# EAGLE design adc_dev (EAGLE 6.5.0)
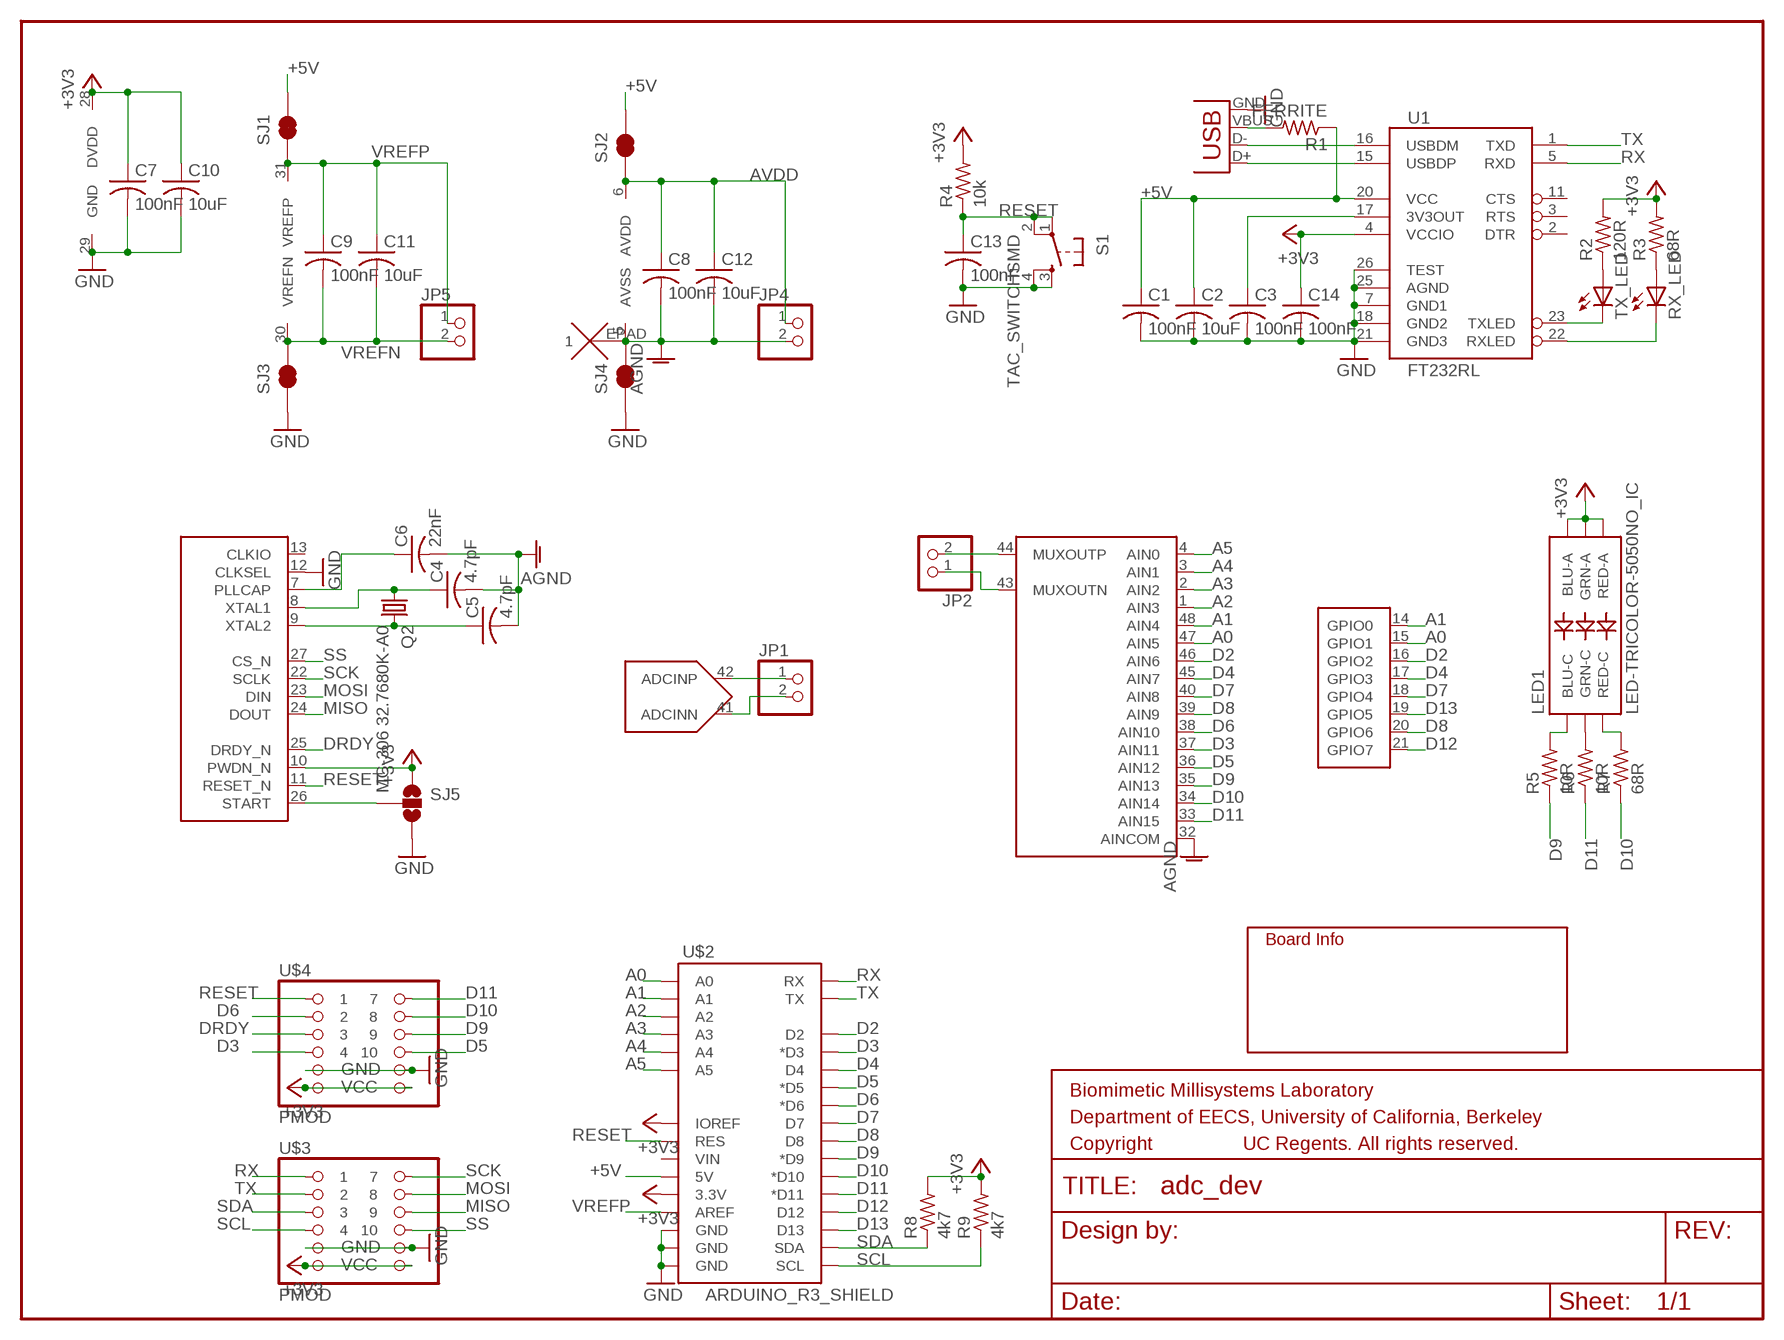
[diagram p0: schematic, sheet 1]

## Parts
C1  100nF  C-USC0603  [C0603]
C2  10uF  C-USC0603  [C0603]
C3  100nF  C-USC0603  [C0603]
C4  4.7pF  C-USC0603  [C0603]
C5  4.7pF  C-USC0603  [C0603]
C6  22nF  C-USC0603  [C0603]
C7  100nF  C-USC0603  [C0603]
C8  100nF  C-USC0603  [C0603]
C9  100nF  C-USC0603  [C0603]
C10  10uF  C-USC0603  [C0603]
C11  10uF  C-USC0603  [C0603]
C12  10uF  C-USC0603  [C0603]
C13  100nF  C-USC0603  [C0603]
C14  100nF  C-USC0603  [C0603]
JP1  PINHD-1X2  [1X02]
JP2  PINHD-1X2  [1X02]
JP3  USBSMD  [USB-MINIB]
JP4  PINHD-1X2  [1X02]
JP5  PINHD-1X2  [1X02]
LED1  LED-TRICOLOR-5050NO_IC  [LED-TRICOLOR-5050]
Q2  MC-306 32.7680K-A0  MC-306  [MC-306]
R1  FERRITE  R-US_R0603  [R0603]
R2  120R  R-US_R0603  [R0603]
R3  68R  R-US_R0603  [R0603]
R4  10k  R-US_R0603  [R0603]
R5  10R  R-US_R0603  [R0603]
R6  10R  R-US_R0603  [R0603]
R7  68R  R-US_R0603  [R0603]
R8  4k7  R-US_R0603  [R0603]
R9  4k7  R-US_R0603  [R0603]
RX_LED  LEDCHIPLED_0603  [CHIPLED_0603]
S1  TAC_SWITCHSMD  [TACTILE_SWITCH_SMD]
SJ1  JUMPER-PAD-2-NC_BY_TRACE  [PAD-JUMPER-2-NC_BY_TRACE_YES_SILK]
SJ2  JUMPER-PAD-2-NC_BY_TRACE  [PAD-JUMPER-2-NC_BY_TRACE_YES_SILK]
SJ3  JUMPER-PAD-2-NC_BY_TRACE  [PAD-JUMPER-2-NC_BY_TRACE_YES_SILK]
SJ4  JUMPER-PAD-2-NC_BY_TRACE  [PAD-JUMPER-2-NC_BY_TRACE_YES_SILK]
SJ5  JUMPER-PAD-3-NOYES_SILK  [PAD-JUMPER-3-NO_YES_SILK]
TX_LED  LEDCHIPLED_0603  [CHIPLED_0603]
U1  FT232RL  FT232RL-BASICSSOP  [SSOP28DB]
U$1  ADS1258  [QFN-48]
U$2  ARDUINO_R3_SHIELD  [UNO_R3_SHIELD]
U$3  PMOD  [2X06]
U$4  PMOD  [2X06]
U$5  INFO  [INFO]

## Nets
+3V3: C7.1 C10.1 C14.1 LED1.1(GRN-A) LED1.2(RED-A) LED1.3(BLU-A) R2.2 R3.2 R4.2 R8.2 R9.2 SJ5.1 U1.4(VCCIO) U$1.10(CTRL:PWDN_N) U$1.28(GND-DVDD:DVDD) U$2.3.3V U$2.IOREF U$3.11 U$3.12 U$4.11 U$4.12
+5V: C1.1 C2.1 R1.1 SJ1.2 SJ2.2 U1.20(VCC) U$2.5V
A0: U$1.15(GPIO:GPIO1) U$1.47(MUX:AIN5) U$2.A0
A1: U$1.14(GPIO:GPIO0) U$1.48(MUX:AIN4) U$2.A1
A2: U$1.1(MUX:AIN3) U$2.A2
A3: U$1.2(MUX:AIN2) U$2.A3
A4: U$1.3(MUX:AIN1) U$2.A4
A5: U$1.4(MUX:AIN0) U$2.A5
ADCN: JP1.2 U$1.41(ADC:ADCINN)
ADCP: JP1.1 U$1.42(ADC:ADCINP)
AGND: C4.2 C5.2 C6.2 C8.2 C12.2 JP4.2 SJ4.2 U$1.5(AVDD-AVSS:AVSS) U$1.32(MUX:AINCOM) U$1.EPAD
AVDD: C8.1 C12.1 JP4.1 SJ2.1 U$1.6(AVDD-AVSS:AVDD)
D2: U$1.16(GPIO:GPIO2) U$1.46(MUX:AIN6) U$2.D2
D3: U$1.37(MUX:AIN11) U$2.D3(*D3) U$4.7
D4: U$1.17(GPIO:GPIO3) U$1.45(MUX:AIN7) U$2.D4
D5: U$1.36(MUX:AIN12) U$2.D5(*D5) U$4.8
D6: U$1.38(MUX:AIN10) U$2.D6(*D6) U$4.3
D7: U$1.18(GPIO:GPIO4) U$1.40(MUX:AIN8) U$2.D7
D8: U$1.20(GPIO:GPIO6) U$1.39(MUX:AIN9) U$2.D8
D9: R5.1 U$1.35(MUX:AIN13) U$2.D9(*D9) U$4.6
D10: R7.1 U$1.34(MUX:AIN14) U$2.D10(*D10) U$4.4
D11: R6.1 U$1.33(MUX:AIN15) U$2.D11(*D11) U$4.2
D12: U$1.21(GPIO:GPIO7) U$2.D12
D13: U$1.19(GPIO:GPIO5) U$2.D13
DRDY: U$1.25(CTRL:DRDY_N) U$4.5
GND: C1.2 C2.2 C3.2 C7.2 C10.2 C13.2 C14.2 JP3.GND S1.3 S1.4 SJ3.1 SJ4.1 SJ5.3 U1.7(GND1) U1.18(GND2) U1.21(GND3) U1.25(AGND) U1.26(TEST) U$1.12(CTRL:CLKSEL) U$1.29(GND-DVDD:GND) U$2.GND@0(GND) U$2.GND@1(GND) U$2.GND@2(GND) U$3.9 U$3.10 U$4.9 U$4.10
MISO: U$1.24(CTRL:DOUT) U$3.6
MOSI: U$1.23(CTRL:DIN) U$3.4
MUXN: JP2.1 U$1.43(MUX:MUXOUTN)
MUXP: JP2.2 U$1.44(MUX:MUXOUTP)
N$1: JP3.D+ U1.15(USBDP)
N$2: JP3.D- U1.16(USBDM)
N$3: R2.1 TX_LED.A
N$4: R3.1 RX_LED.A
N$5: C3.1 U1.17(3V3OUT)
N$6: SJ5.2 U$1.26(CTRL:START)
N$7: JP3.VBUS R1.2
N$8: TX_LED.C U1.23(TXLED)
N$9: RX_LED.C U1.22(RXLED)
N$13: C6.1 U$1.7(CTRL:PLLCAP)
N$14: C4.1 Q2.1 U$1.8(CTRL:XTAL1)
N$15: C5.1 Q2.4 U$1.9(CTRL:XTAL2)
N$17: LED1.4(BLU-C) R5.2
N$18: LED1.6(GRN-C) R6.2
N$21: LED1.5(RED-C) R7.2
RESET: C13.1 R4.1 S1.1 S1.2 U$1.11(CTRL:RESET_N) U$2.RES U$4.1
RX: U1.5(RXD) U$2.RX U$3.1
SCK: U$1.22(CTRL:SCLK) U$3.2
SCL: R9.1 U$2.SCL U$3.7
SDA: R8.1 U$2.SDA U$3.5
SS: U$1.27(CTRL:CS_N) U$3.8
TX: U1.1(TXD) U$2.TX U$3.3
VREFN: C9.2 C11.2 JP5.2 SJ3.2 U$1.30(VREFN-VREFP:VREFN)
VREFP: C9.1 C11.1 JP5.1 SJ1.1 U$1.31(VREFN-VREFP:VREFP) U$2.AREF
Unconnected: U1.2(DTR) U1.3(RTS) U1.11(CTS) U$1.13(CTRL:CLKIO) U$2.VIN

## Library data of the parts
C1-C14 = rcl:C-US: CAPACITOR, American symbol
JP1 JP2 JP4 JP5 = pinhead:PINHD-1X2: PIN HEADER
JP3 = SparkFun-Connectors:USB: USB Connectors USB-B-PTH is fully proven SKU : PRT-00139/CONN-08278 USB-miniB is fully proven SKU : PRT-00587 USB-A-PCB is untested. USB-A-H is throughly reviewed, but untested. Spark Fun Electronics SKU : PRT-00437 USB-B-SMT is throughly reviewed, but untested. Needs silkscreen touching up. USB-A-S has not been used/tested USB-MB-H has not been used/tested USB-MICROB has been used. CONN-09505; PROD_ID: CONN-08193
LED1 = SparkFun-LED:LED-TRICOLOR-5050
Q2 = crystal:MC-306: kHz RANGE CRYSTAL UNIT SMD Source: MC-306_405_406_E07X.PDF Homepage <http://www.epsontoyocom.co.jp>; MPN: MC-306 60.0KHZ 100PPM ,12.5PF; OC_FARNELL: 1278040; OC_NEWARK: 31M5576
R1-R9 = rcl:R-US_: RESISTOR, American symbol
RX_LED TX_LED = led:LED: LED OSRAM: - CHIPLED LG R971, LG N971, LY N971, LG Q971, LY Q971, LO R971, LY R971 LH N974, LH R974 LS Q976, LO Q976, LY Q976 LO Q996 - Hyper CHIPLED LW Q18S LB Q993, LB Q99A, LB R99A - SideLED LS A670, LO A670, LY A670, LG A670, LP A670 LB A673, LV A673, LT A673, LW A673 LH A674 LY A675 LS A676, LA A676, LO A676, LY A676, LW A676 LS A679, LY A679, LG A679 - Hyper Micro SIDELED® LS Y876, LA Y876, LO Y876, LY Y876 LT Y87S - SmartLED LW L88C, LW L88S LB L89C, LB L89S, LG L890 LS L89K, LO L89K, LY L89K LS L896, LA L896, LO L896, LY L896 - TOPLED LS T670, LO T670, LY T670, LG T670, LP T670 LSG T670, LSP T670, LSY T670, LOP T670, LYG T670 LG T671, LOG T671, LSG T671 LB T673, LV T673, LT T673, LW T673 LH T674 LS T676, LA T676, LO T676, LY T676, LB T676, LH T676, LSB T676, LW T676 LB T67C, LV T67C, LT T67C, LS T67K, LO T67K, LY T67K, LW E67C LS E67B, LA E67B, LO E67B, LY E67B, LB E67C, LV E67C, LT E67C LW T67C LS T679, LY T679, LG T679 LS T770, LO T770, LY T770, LG T770, LP T770 LB T773, LV T773, LT T773, LW T773 LH T774 LS E675, LA E675, LY E675, LS T675 LS T776, LA T776, LO T776, LY T776, LB T776 LHGB T686 LT T68C, LB T68C - Hyper Mini TOPLED® LB M676 - Mini TOPLED Santana® LG M470 LS M47K, LO M47K, LY M47K Source: http://www.osram.convergy.de LUXEON: - LUMILED® LXK2-PW12-R00, LXK2-PW12-S00, LXK2-PW14-U00, LXK2-PW14-V00 LXK2-PM12-R00, LXK2-PM12-S00, LXK2-PM14-U00 LXK2-PE12-Q00, LXK2-PE12-R00, LXK2-PE12-S00, LXK2-PE14-T00, LXK2-PE14-U00 LXK2-PB12-K00, LXK2-PB12-L00, LXK2-PB12-M00, LXK2-PB14-N00, LXK2-PB14-P00, LXK2-PB14-Q00 LXK2-PR12-L00, LXK2-PR12-M00, LXK2-PR14-Q00, LXK2-PR14-R00 LXK2-PD12-Q00, LXK2-PD12-R00, LXK2-PD12-S00 LXK2-PH12-R00, LXK2-PH12-S00 LXK2-PL12-P00, LXK2-PL12-Q00, LXK2-PL12-R00 Source: www.luxeon.com KINGBRIGHT: KA-3528ASYC Source: www.kingbright.com
S1 = SparkFun-Electromechanical:TAC_SWITCH: Momentary Switch Button commonly used for reset or general input. Spark Fun Electronics SKU : COM-00097 SMT- SWCH-08247; PROD_ID: SWCH-08247
SJ1-SJ4 = SparkFun-Passives:JUMPER-PAD-2-NC_BY_TRACE
SJ5 = SparkFun-Passives:JUMPER-PAD-3-NO
U1 = SparkFun-DigitalIC:FT232RL-BASIC: USB UART This is the simplified version of the FT232RL unit. Only what you need, nothing you don't. Spark Fun Electronics SKU : COM-00650
U$1 = modular_robotics:ADS1258
U$2 = SparkFun-Boards:ARDUINO_R3_SHIELD: Shield form compatible with the Arduino Uno R3.
U$3 U$4 = modular_robotics:PMOD
U$5 = modular_robotics:INFO; AUTHOR: Austin Buchan; DATE: Nov 18, 2014; DESIGN: Zedboard Arduino Adapter; ORGANIZATION: UC Berkeley ASPIRE; REVISION: r0.1

## Board
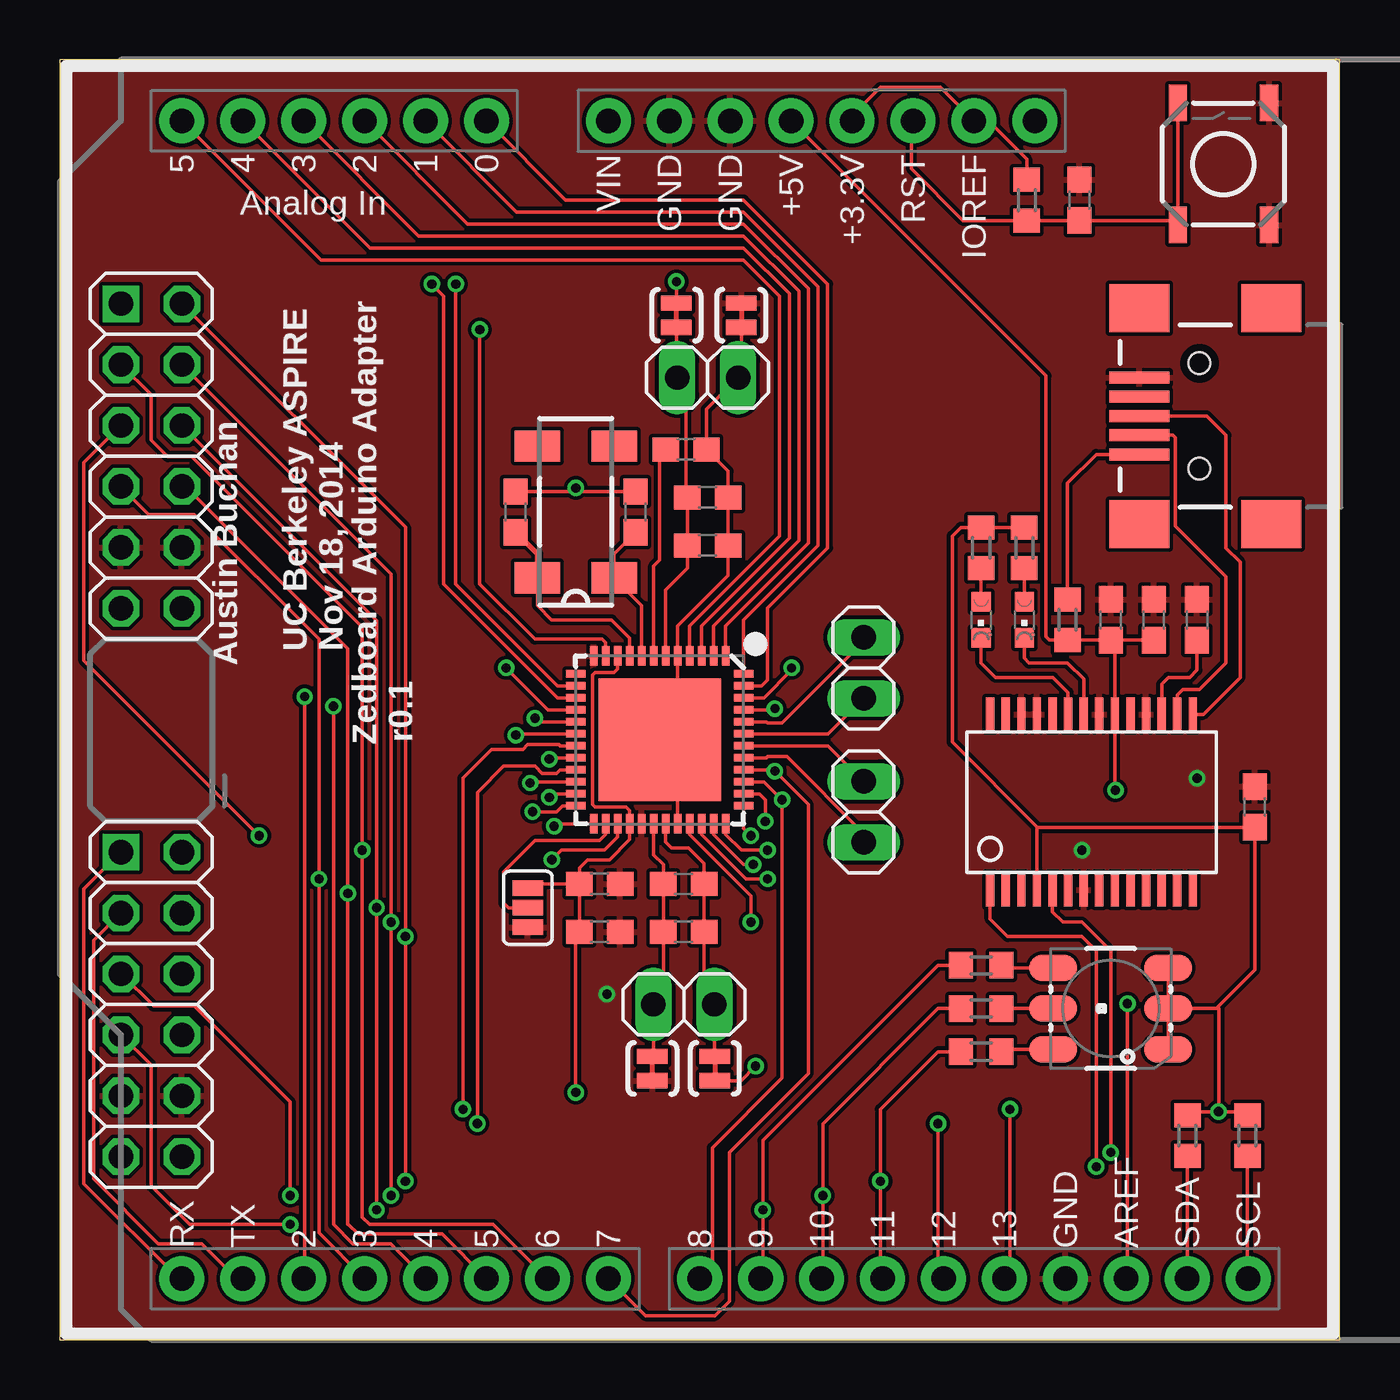
[diagram p1: board, top side]
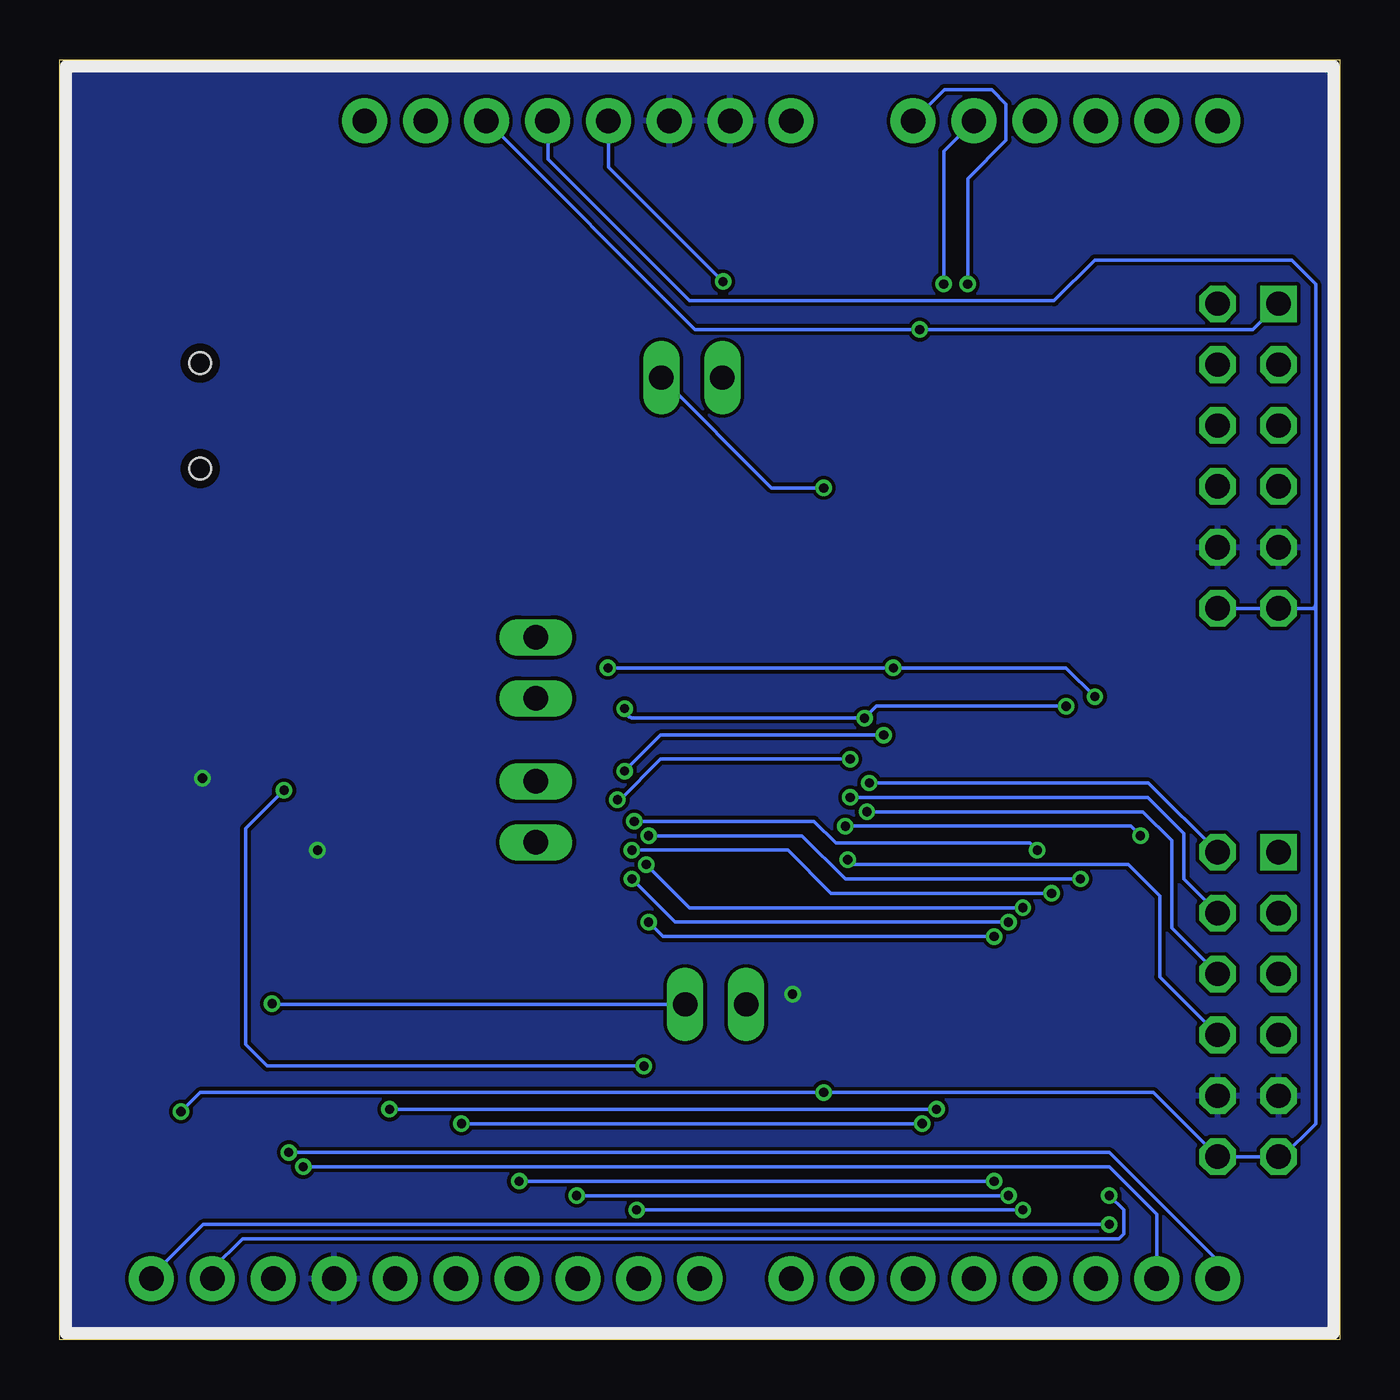
[diagram p2: board, bottom side, seen from below]

Size 53.34 x 53.34 mm. Coordinates in mm from the lower left corner, seen from the top.
Outline: 0,0 53.34,0 53.34,53.34 0,53.34 0,0
Copper layers (1*2+15*16): Top 0.035mm / dielectric 1.5mm / Route2 0.035mm / dielectric 0.15mm / Route15 0.035mm / dielectric 0.2mm / Bottom 0.035mm
Design rules "66each *": minimum track width 6mil, minimum drill 15mil, track to track 6mil, track to pad 6mil, pad to pad 6mil, via to via 6mil, smd to smd 6mil, copper to edge 6mil, drill to drill 10mil, minimum pad ring 6mil, minimum via ring 6mil, stop-mask expansion 4mil, vias tented up to drill 14mil, thermal gap 6mil
tRestrict: area 46.7,39.9 to 48.3,41.5; area 46.7,35.5 to 48.3,37.1
bRestrict: area 46.7,35.5 to 48.3,37.1; area 46.7,39.9 to 48.3,41.5

### Footprints (pad centres in the part's own frame; a part is rotated, then mirrored left to right if it is on the bottom)
C0603 = smd 1.1 x 1: 1 -0.85,0; 2 0.85,0
1X02 = drill 1.016 long: 1 -1.27,0; 2 1.27,0
USB-MINIB = smd 2.5 x 0.5: D+ 2.5,0; D- 2.5,0.8; GND 2.5,-1.6; ID 2.5,-0.8; VBUS 2.5,1.6 | smd 2.5 x 2: MTN1 -3,4.5; MTN2 2.5,4.5; MTN3 -3,-4.5; MTN4 2.5,-4.5 | hole 0.9: 0,2.2; 0,-2.2
LED-TRICOLOR-5050 = smd 2 x 1.1: 1 -2.4,1.7; 2 -2.4,0; 3 -2.4,-1.7; 4 2.4,-1.7; 5 2.4,0; 6 2.4,1.7
MC-306 = smd 1.3 x 1.9: 1 -2.75,-1.6; 2 2.75,-1.6; 3 2.75,1.6; 4 -2.75,1.6
R0603 = smd 1 x 1.1: 1 -0.85,0; 2 0.85,0
CHIPLED_0603 = smd 0.8 x 0.8: A 0,-0.75; C 0,0.75
TACTILE_SWITCH_SMD = smd 1.524 x 0.762: 1 -2.54,1.905; 2 2.54,1.905; 3 -2.54,-1.905; 4 2.54,-1.905
PAD-JUMPER-2-NC_BY_TRACE_YES_SILK = smd 0.635 x 1.27: 1 -0.508,0; 2 0.508,0
PAD-JUMPER-3-NO_YES_SILK = smd 0.635 x 1.27: 1 -0.813,0; 2 0,0; 3 0.813,0
SSOP28DB = smd 0.348 x 1.397: 1 -4.225,-3.656; 2 -3.575,-3.656; 3 -2.925,-3.656; 4 -2.275,-3.656; 5 -1.625,-3.656; 6 -0.975,-3.656; 7 -0.325,-3.656; 8 0.325,-3.656; 9 0.975,-3.656; 10 1.625,-3.656; 11 2.275,-3.656; 12 2.925,-3.656; 13 3.575,-3.656; 14 4.225,-3.656; 15 4.225,3.656; 16 3.575,3.656; 17 2.925,3.656; 18 2.275,3.656; 19 1.625,3.656; 20 0.975,3.656; 21 0.325,3.656; 22 -0.325,3.656; 23 -0.975,3.656; 24 -1.625,3.656; 25 -2.275,3.656; 26 -2.925,3.656; 27 -3.575,3.656; 28 -4.225,3.656
QFN-48 = smd 0.8 x 0.3: 1 -3.5,2.75; 2 -3.5,2.25; 3 -3.5,1.75; 4 -3.5,1.25; 5 -3.5,0.75; 6 -3.5,0.25; 7 -3.5,-0.25; 8 -3.5,-0.75; 9 -3.5,-1.25; 10 -3.5,-1.75; 11 -3.5,-2.25; 12 -3.5,-2.75; 25 3.5,-2.75; 26 3.5,-2.25; 27 3.5,-1.75; 28 3.5,-1.25; 29 3.5,-0.75; 30 3.5,-0.25; 31 3.5,0.25; 32 3.5,0.75; 33 3.5,1.25; 34 3.5,1.75; 35 3.5,2.25; 36 3.5,2.75 | smd 0.3 x 0.8: 13 -2.75,-3.5; 14 -2.25,-3.5; 15 -1.75,-3.5; 16 -1.25,-3.5; 17 -0.75,-3.5; 18 -0.25,-3.5; 19 0.25,-3.5; 20 0.75,-3.5; 21 1.25,-3.5; 22 1.75,-3.5; 23 2.25,-3.5; 24 2.75,-3.5; 37 2.75,3.5; 38 2.25,3.5; 39 1.75,3.5; 40 1.25,3.5; 41 0.75,3.5; 42 0.25,3.5; 43 -0.25,3.5; 44 -0.75,3.5; 45 -1.25,3.5; 46 -1.75,3.5; 47 -2.25,3.5; 48 -2.75,3.5 | smd 5.1 x 5.1: EPAD 0,0
UNO_R3_SHIELD = drill 1.016 pad 1.88: 3.3V 50.8,26.67; 5V 50.8,29.21; A0 50.8,41.91; A1 50.8,44.45; A2 50.8,46.99; A3 50.8,49.53; A4 50.8,52.07; A5 50.8,54.61; AREF 2.54,15.24; D2 2.54,49.53; D3 2.54,46.99; D4 2.54,44.45; D5 2.54,41.91; D6 2.54,39.37; D7 2.54,36.83; D8 2.54,33.02; D9 2.54,30.48; D10 2.54,27.94; D11 2.54,25.4; D12 2.54,22.86; D13 2.54,20.32; GND@0 50.8,31.75; GND@1 50.8,34.29; GND@2 2.54,17.78; IOREF 50.8,21.59; NC 50.8,19.05; RES 50.8,24.13; RX 2.54,54.61; SCL 2.54,10.16; SDA 2.54,12.7; TX 2.54,52.07; VIN 50.8,36.83
2X06 = drill 1.016 square: 1 -6.35,-1.27 | drill 1.016 octagon: 2 -6.35,1.27; 3 -3.81,-1.27; 4 -3.81,1.27; 5 -1.27,-1.27; 6 -1.27,1.27; 7 1.27,-1.27; 8 1.27,1.27; 9 3.81,-1.27; 10 3.81,1.27; 11 6.35,-1.27; 12 6.35,1.27

### Placement (x,y rotation side)
C1  43.8,30 90 top
C2  45.6,30 90 top
C3  47.4,30 90 top
C4  24,34.5 90 top
C5  19,34.5 90 top
C6  26.1,37.1 0 top
C7  22.5,19 0 top
C8  27,33.1 0 top
C9  26,19 180 top
C10  22.5,17 0 top
C11  26,17 180 top
C12  27,35.1 0 top
C13  42.5,47.5 90 top
C14  49.8,22.2 90 top
JP1  33.5,22 270 top
JP2  33.5,28 90 top
JP3  47.5,38.5 180 top
JP4  27,40.1 0 top
JP5  26.01,13.97 180 top
LED1  43.8,13.8 180 top
Q2  21.5,34.5 90 top
R1  42,30 90 top
R2  38.4,33 90 top
R3  40.2,33 90 top
R4  40.3,47.5 90 top
R5  38.4,15.6 0 top
R6  38.4,12 0 top
R7  38.4,13.8 0 top
R8  47,8.5 90 top
R9  49.5,8.5 90 top
RX_LED  40.2,30 180 top
S1  48.5,49 90 top
SJ1  27.3,11.3 270 top
SJ2  25.7,42.7 90 top
SJ3  24.7,11.3 90 top
SJ4  28.4,42.7 270 top
SJ5  19.5,18 270 top
TX_LED  38.4,30 180 top
U1  43,22.4 0 top
U$1  25,25 270 top
U$2  59.69,0 90 top
U$3  3.81,13.97 270 top
U$4  3.81,36.83 270 top
U$5  13.6,28 90 top

### Tracks (layer width: path | path; a pad name or v marks a point on that pad's centre or on a via)
+3V3  (via drill 0.38)
  Top 0.152: U$1.10 23.25,27.95 23.1,27.8 22.3,27.8 22.2,27.7 22.2,22.3 22.3,22.2 23.6,22.2 23.75,22.05 U$1.28 23.75,20.85 22.9,20 22,20 21.65,19.65 C7.1 | C7.1 C10.1 21.5,16.85 v21.5,10.3 | C7.1 19.69,19 SJ5.1 | R9.2 49.35,9.5 v48.3,9.5 | R8.2 47.15,9.5 v48.3,9.5 | LED1.2 48.2,13.8 | 48.2,13.8 48.3,13.8 v48.3,9.5 | LED1.3 LED1.2 | LED1.1 LED1.2 | R4.2 40.3,49.2 38.7,50.8 U$2.IOREF 36.7,52.2 34.2,52.2 33.02,51.02 U$2.3.3V | 48.2,13.8 49.8,15.4 C14.1 40.75,21.35 | R3.2 R2.2 37.55,33.85 37.2,33.5 37.2,24.9 40.75,21.35 | U1.4 40.73,21.32 40.75,21.35
  Bottom 0.152: 33,50.8 U$2.3.3V 33,50.78 33,49.2 27.1,43.3 11.9,43.3 10.2,45 2,45 1,44 1,30.6 | U$4.11 2.52,30.48 | U$4.12 U$4.11 | 1,30.6 1,9 2.38,7.62 U$3.11 U$3.12 7.76,10.3 v21.5,10.3 47.5,10.3 v48.3,9.5 | U$4.11 1.12,30.48 arc-90 1,30.6
+5V  (via drill 0.38)
  Top 0.152: C1.1 R1.1 41.25,29.15 41.1,29.3 41.1,40.18 U$2.5V | C2.1 C1.1 | C1.1 43.98,28.98 U1.20 43.98,22.93 v44,22.9 | v25.7,44.1 SJ2.2 | SJ1.2 28.39,10.79 v29,11.4
  Bottom 0.152: U$2.5V 30.48,48.88 v25.7,44.1 | v29,11.4 44.7,11.4 45.6,12.3 45.6,21.3 v44,22.9
A0  (via drill 0.38)
  Top 0.152: U$1.47 29.25,27.25 29.5,27.5 29.5,30.5 32,33 32,44 28.5,47.5 21.08,47.5 U$2.A0 | U$1.15 20.75,26.75 16,31.5 16,43.5 v15.5,44
  Bottom 0.152: v15.5,44 15.5,48.4 13.9,50 13.9,51.5 14.5,52.1 16.48,52.1 U$2.A0
A1  (via drill 0.38)
  Top 0.152: U$1.48 28.5,30 31.6,33.1 31.6,43.9 28.5,47 19.04,47 U$2.A1 | U$1.14 20.75,27.25 16.5,31.5 v16.5,44
  Bottom 0.152: v16.5,44 16.5,49.54 U$2.A1
A2
  Top 0.152: U$1.1 27.75,29.75 31.2,33.2 31.2,43.8 28.5,46.5 17,46.5 U$2.A2
A3
  Top 0.152: U$1.2 27.25,29.75 30.8,33.3 30.8,43.7 28.5,46 14.96,46 U$2.A3
A4
  Top 0.152: U$1.3 26.75,29.75 30.4,33.4 30.4,43.6 28.5,45.5 12.92,45.5 U$2.A4
A5
  Top 0.152: U$1.4 26.25,29.75 30,33.5 30,43.5 28.5,45 10.88,45 U$2.A5
ADCN
  Top 0.152: U$1.41 29.45,24.25 29.5,24.3 30.3,24.3 33.5,21.1 JP1.2
ADCP
  Top 0.152: U$1.42 32.02,24.75 JP1.1
AGND  (via drill 0.38)
  Top 0.152: SJ4.2 28.4,40.23 JP4.2 26.95,38.78 C6.2 27.85,36.2 C12.2 C8.2 27.85,31.85 25.75,29.75 U$1.5 25.75,25.75 U$1.EPAD 25.75,24.25 U$1.32 | C5.2 21.35,35.35 v21.5,35.5 21.65,35.35 C4.2
  Bottom 0.152: v21.5,35.5 23.67,35.5 JP4.2
AVDD
  Top 0.152: U$1.6 25.25,31.25 26.15,32.15 C8.1 C12.1 26.1,35.15 26.1,39.73 JP4.1 25.7,40.13 SJ2.1
D2  (via drill 0.38)
  Top 0.152: v10.2,26.8 10.2,2.58 U$2.D2 | U$1.46 29.35,26.75 30.5,27.9 v30.5,28 | v18.6,28 20.35,26.25 U$1.16
  Bottom 0.152: v30.5,28 v18.6,28 11.4,28 v10.2,26.8
D3  (via drill 0.38)
  Top 0.152: U$4.7 3.7,34.4 5.6,34.4 10.8,29.2 v10.8,19.2 10.8,4.44 U$2.D3 | U$1.37 28.5,21.3 v28.8,21
  Bottom 0.152: v10.8,19.2 20.6,19.2 22.4,21 v28.8,21
D4  (via drill 0.38)
  Top 0.152: v11.4,26.4 11.4,4.8 12.2,4 13.78,4 U$2.D4 | v29.8,26.3 29.75,26.25 U$1.45 | U$1.17 19.95,25.75 v19.8,25.9
  Bottom 0.152: v11.4,26.4 19.3,26.4 v19.8,25.9 29.4,25.9 arc90 v29.8,26.3
D5  (via drill 0.38)
  Top 0.152: U$4.8 5.24,35.56 12,28.8 v12,18.6 12,4.81 12.01,4.81 12.42,4.4 15.92,4.4 U$2.D5 | U$1.36 27.75,21.05 28.4,20.4 v29.5,20.4
  Bottom 0.152: v12,18.6 21.2,18.6 23,20.4 v29.5,20.4
D6  (via drill 0.38)
  Top 0.152: U$1.38 29.15,22.75 29.4,22.5 v29.4,21.6 | U$4.3 3.8,39.38 3.8,37.5 4.5,36.8 5.5,36.8 12.6,29.7 v12.6,20.4 12.6,5.1 12.9,4.8 18.06,4.8 U$2.D6
  Bottom 0.152: v12.6,20.4 12.9,20.7 21,20.7 21.9,21.6 v29.4,21.6
D7  (via drill 0.38)
  Top 0.152: U$2.D7 24.4,1 27.3,1 27.9,1.6 27.9,7.8 31.2,11.1 31.2,22.3 v29.8,23.7 29.75,23.75 U$1.40 | U$1.18 19.05,25.25 v19,25.2
  Bottom 0.152: v29.8,23.7 28.3,25.2 v19,25.2
D8  (via drill 0.38)
  Top 0.152: U$1.39 29.35,23.25 v30.1,22.5 30.1,10.9 27.2,8 27.2,3.07 U$2.D8 | U$1.20 20.45,24.25 v20.4,24.2
  Bottom 0.152: v30.1,22.5 30,22.5 28.3,24.2 v20.4,24.2
D9  (via drill 0.38)
  Top 0.152: v13.2,5.4 v13.2,18 13.2,29.98 U$4.6 | U$1.35 27.25,21.05 28.5,19.8 v28.9,19.8 | U$2.D9 29.3,2.63 v29.3,5.4 29.3,8.3 36.6,15.6 R5.1
  Bottom 0.152: v13.2,5.4 v29.3,5.4 | v13.2,18 27.1,18 v28.9,19.8
D10  (via drill 0.38)
  Top 0.152: U$1.34 26.75,21.05 28.6,19.2 v29.5,19.2 | v13.8,6 v13.8,17.4 13.8,31.92 U$4.4 | U$2.D10 31.8,2.59 v31.8,6 31.8,9 36.6,13.8 R7.1
  Bottom 0.152: v13.8,6 v31.8,6 | v29.5,19.2 27.7,17.4 v13.8,17.4
D11  (via drill 0.38)
  Top 0.152: U$1.33 26.25,21.05 28.8,18.5 v28.8,17.4 | v14.4,6.6 v14.4,16.8 14.4,33.86 U$4.2 | U$2.D11 34.2,2.63 v34.2,6.6 34.2,9.6 36.6,12 R6.1
  Bottom 0.152: v14.4,6.6 v34.2,6.6 | v28.8,17.4 28.2,16.8 v14.4,16.8
D12  (via drill 0.38)
  Top 0.152: v17.4,9 17.4,22.8 18.5,23.9 19.8,23.9 20.1,23.6 20.7,23.6 20.85,23.75 U$1.21 | v36.6,9 36.6,2.77 U$2.D12
  Bottom 0.152: v36.6,9 v17.4,9
D13  (via drill 0.38)
  Top 0.152: v16.8,9.6 16.8,23.4 18,24.6 19.3,24.6 19.5,24.8 20.8,24.8 20.85,24.75 U$1.19 | v39.6,9.6 39.6,2.77 U$2.D13
  Bottom 0.152: v39.6,9.6 v16.8,9.6
DRDY  (via drill 0.38)
  Top 0.152: v8.3,21 1,28.3 1,36.56 U$4.5 | U$1.25 20.7,21.5 v20.6,21.4
  Bottom 0.152: v20.6,21.4 8.7,21.4 v8.3,21
GND  (via drill 0.38)
  other vias: 22.8,14.4 42.6,20.4 47.4,23.4
  pour Top: 0,0 53.34,0 53.34,53.34 0,53.34
  pour Bottom (isolate 0.01): 0,0 53.34,0 53.34,53.34 0,53.34
MISO  (via drill 0.38)
  Top 0.152: U$1.24 20.95,22.25 20.7,22 v19.7,22
  Bottom 0.152: U$3.6 7,17.16 7,20.8 8.2,22 v19.7,22
MOSI  (via drill 0.38)
  Top 0.152: U$1.23 20.55,22.75 v20.4,22.6
  Bottom 0.152: v20.4,22.6 8,22.6 6.5,21.1 6.5,19.2 U$3.4
MUXN
  Top 0.152: U$1.43 32.02,25.25 JP2.1
MUXP
  Top 0.152: U$1.44 29.45,25.75 29.5,25.7 30.1,25.7 33.5,29.1 JP2.2
N$1
  Top 0.152: U1.15 47.66,26.06 49.2,27.6 49.2,32.4 48.6,33 48.6,37.7 47.8,38.5 JP3.D+
N$2
  Top 0.152: U1.16 46.58,26.88 46.8,27.1 47.5,27.1 48.6,28.2 48.6,31.8 46.5,33.9 46.5,37.6 46.4,37.7 JP3.D-
N$3
  Top 0.152: TX_LED.A R2.1
N$4
  Top 0.152: RX_LED.A R3.1
N$5
  Top 0.152: U1.17 45.92,27.32 46.2,27.6 47.1,27.6 47.4,27.9 C3.1
N$6
  Top 0.152: U$1.26 22.75,21.05 22.5,20.8 19.8,20.8 18.5,19.5 18.5,18.2 18.7,18 SJ5.2
N$7
  Top 0.152: R1.2 42,35.7 43.2,36.9 JP3.VBUS
N$8
  Top 0.152: U1.23 42.02,26.98 41.4,27.6 39,27.6 38.4,28.2 TX_LED.C
N$9
  Top 0.152: U1.22 42.67,27.52 42,28.2 40.4,28.2 40.2,28.4 RX_LED.C
N$13
  Top 0.152: U$1.7 24.75,32.25 25,32.5 25,36.85 C6.1
N$14
  Top 0.152: U$1.8 24.25,30.6 Q2.1 23.1,32.75 C4.1
N$15
  Top 0.152: U$1.9 23.75,29.25 23,30 20.5,30 19.9,30.6 Q2.4
  Top 0.2: Q2.4 19.9,32.75 C5.1
N$17
  Top 0.152: R5.2 39.35,15.5 LED1.4
N$18
  Top 0.152: R6.2 39.35,12.1 LED1.6
N$21
  Top 0.152: R7.2 LED1.5
RESET  (via drill 0.38)
  Top 0.152: U$1.11 22.75,29.05 22.6,29.2 19.8,29.2 17.5,31.5 v17.5,42.1 | S1.2 S1.1 46.41,46.65 C13.1 R4.1 37.65,46.65 35.5,48.8 35.5,50.74 U$2.RES
  Bottom 0.152: U$2.RES 26.86,42.1 v17.5,42.1 3.62,42.1 U$4.1
RX  (via drill 0.38)
  Top 0.152: U$3.1 1,18.78 1,6.5 4.96,2.54 U$2.RX | U1.5 41.38,17.82 41.8,17.4 42.6,17.4 43.8,16.2 v43.8,7.8
  Bottom 0.152: v43.8,7.8 9.6,7.8 5.08,3.28 U$2.RX
SCK  (via drill 0.38)
  Top 0.152: U$1.22 19.65,23.25 v19.6,23.2
  Bottom 0.152: U$3.2 7.96,23.2 v19.6,23.2
SCL  (via drill 0.38)
  Top 0.152: U$3.7 3.8,11.44 3.8,6.4 5.4,4.8 v9.6,4.8 | R9.1 49.5,2.57 U$2.SCL
  Bottom 0.152: v9.6,4.8 47.37,4.8 49.53,2.64 U$2.SCL
SDA  (via drill 0.38)
  Top 0.152: U$3.5 2.56,15.24 3.9,13.9 5.6,13.9 9.6,9.9 v9.6,6 | R8.1 U$2.SDA
  Bottom 0.152: U$2.SDA 46.99,2.94 45.73,4.2 9.2,4.2 9,4.4 9,5.4 v9.6,6
SS  (via drill 0.38)
  Top 0.152: U$1.27 23.25,20.95 22.7,20.4 20.9,20.4 v20.5,20
  Bottom 0.152: U$3.8 7.5,15.12 7.5,18.5 8.8,19.8 20.3,19.8 v20.5,20
TX  (via drill 0.38)
  Top 0.152: U$3.3 1.4,16.64 1.4,6.7 4.1,4 5.9,4 7.36,2.54 U$2.TX | v43.2,7.2 43.2,16.2 42.6,16.8 39.5,16.8 38.77,17.52 U1.1
  Bottom 0.152: U$2.TX 7.62,5.22 9.6,7.2 v43.2,7.2
VREFN
  Top 0.152: U$1.30 24.75,20.2 25.15,19.8 C9.2 C11.2 25.15,14.38 JP5.2 24.74,11.85 SJ3.2
VREFP  (via drill 0.38)
  Top 0.152: U$1.31 25.25,20.75 25.5,20.5 26.2,20.5 26.85,19.85 C9.1 C11.1 26.85,14.4 JP5.1 27.28,11.83 SJ1.1 | U$2.AREF 44.5,2.59 v44.5,14
  Bottom 0.152: v44.5,14 44.47,13.97 JP5.1

### Text on the board
tValues: AVDD | AGND | MUXP | MUXN | austin.d.buchan@gmail.com | ADCP | ADCN | REFP | REFN